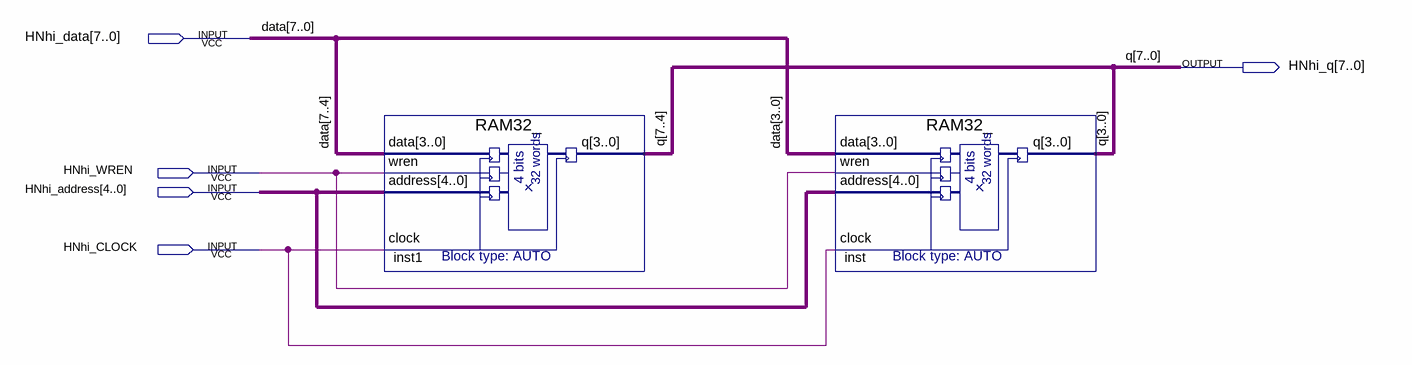
[diagram p0: schematic sheet]
// Quartus schematic Assignment7.bdf as structural Verilog: 2 symbols, 5 pins
module Assignment7 (
  input  [7:0] HNhi_data,
  input  HNhi_WREN,
  input  [4:0] HNhi_address,
  input  HNhi_CLOCK,
  output [7:0] HNhi_q
);

  RAM32_ inst1 (.data(HNhi_data[7:4]), .wren(HNhi_WREN), .address(HNhi_address), .clock(HNhi_CLOCK), .q(HNhi_q[7:4]));
  RAM32_ inst (.data(HNhi_data[3:0]), .wren(HNhi_WREN), .address(HNhi_address), .clock(HNhi_CLOCK), .q(HNhi_q[3:0]));

  // Other names for the same wires on the sheet: data[7:0] = HNhi_data; q[7:0] = HNhi_q
endmodule
